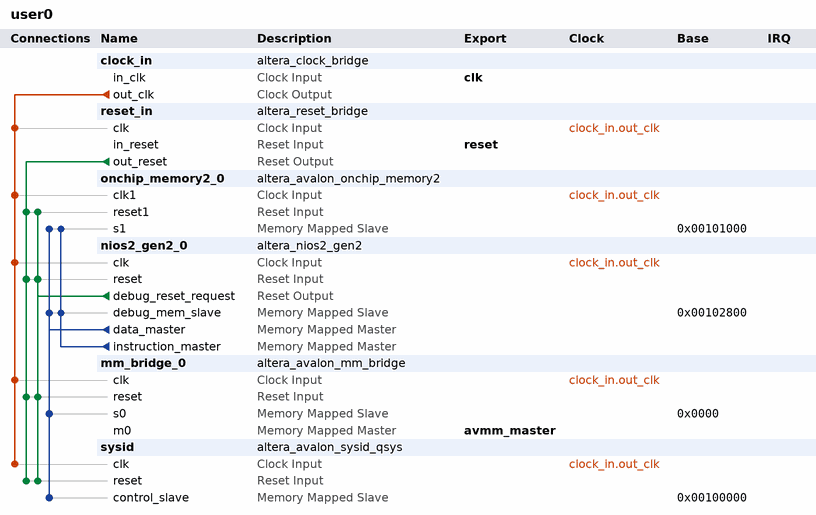
[diagram p0: system contents]
# Platform Designer (Qsys) system user0, Stratix 10 1SG280HU2F50E2VGS1
# Parameters at their usual value, and those the tool derives, are not listed.
package require -exact qsys 1.0
create_system user0
set_project_property DEVICE_FAMILY {Stratix 10}
set_project_property DEVICE 1SG280HU2F50E2VGS1

add_component clock_in ip/user0/user0_clock_in.ip altera_clock_bridge clock_in 18.0
load_component clock_in
set_component_parameter_value DERIVED_CLOCK_RATE 50000000
set_component_parameter_value EXPLICIT_CLOCK_RATE 50000000
save_component

add_component reset_in ip/user0/user0_reset_in.ip altera_reset_bridge reset_in 18.0
load_component reset_in
set_component_parameter_value ACTIVE_LOW_RESET 0
set_component_parameter_value SYNCHRONOUS_EDGES deassert
set_component_parameter_value SYNC_RESET 0
save_component

add_component onchip_memory2_0 ip/user0/user0_onchip_memory2_0.ip altera_avalon_onchip_memory2 onchip_memory2_0 18.0
load_component onchip_memory2_0
set_component_parameter_value dataWidth 32
set_component_parameter_value dualPort false
set_component_parameter_value initMemContent true
set_component_parameter_value initializationFileName onchip_mem.hex
set_component_parameter_value memorySize 4096
save_component

add_component nios2_gen2_0 ip/user0/user0_nios2_gen2_0.ip altera_nios2_gen2 nios2_gen2_0 18.0
load_component nios2_gen2_0
set_component_parameter_value resetSlave onchip_memory2_0.s1
set_component_parameter_value exceptionSlave onchip_memory2_0.s1
set_component_parameter_value impl Tiny
set_component_parameter_value icache_size 2048
set_component_parameter_value dcache_size 2048
save_component

add_component mm_bridge_0 ip/user0/user0_mm_bridge_0.ip altera_avalon_mm_bridge mm_bridge_0 18.0
load_component mm_bridge_0
set_component_parameter_value DATA_WIDTH 32
set_component_parameter_value ADDRESS_WIDTH 20
set_component_parameter_value USE_AUTO_ADDRESS_WIDTH 0
set_component_parameter_value ADDRESS_UNITS SYMBOLS
set_component_parameter_value MAX_PENDING_RESPONSES 4
set_component_parameter_value SYNC_RESET 0
save_component

add_component sysid ip/user0/user0_sysid_qsys_0.ip altera_avalon_sysid_qsys sysid 18.0
load_component sysid
set_component_parameter_value id 0
set_component_parameter_value ID_VALUE 0
set_component_parameter_value TIMESTAMP 0
save_component

# connections
add_connection clock_in.out_clk mm_bridge_0.clk clock
add_connection clock_in.out_clk nios2_gen2_0.clk clock
add_connection clock_in.out_clk onchip_memory2_0.clk1 clock
add_connection clock_in.out_clk reset_in.clk clock
add_connection clock_in.out_clk sysid.clk clock
add_connection nios2_gen2_0.debug_reset_request mm_bridge_0.reset reset
add_connection nios2_gen2_0.debug_reset_request nios2_gen2_0.reset reset
add_connection nios2_gen2_0.debug_reset_request onchip_memory2_0.reset1 reset
add_connection nios2_gen2_0.debug_reset_request sysid.reset reset
add_connection reset_in.out_reset mm_bridge_0.reset reset
add_connection reset_in.out_reset nios2_gen2_0.reset reset
add_connection reset_in.out_reset onchip_memory2_0.reset1 reset
add_connection reset_in.out_reset sysid.reset reset
add_connection nios2_gen2_0.data_master mm_bridge_0.s0 avalon
set_connection_parameter_value nios2_gen2_0.data_master/mm_bridge_0.s0 baseAddress 0x0000
add_connection nios2_gen2_0.data_master nios2_gen2_0.debug_mem_slave avalon
set_connection_parameter_value nios2_gen2_0.data_master/nios2_gen2_0.debug_mem_slave baseAddress 0x00102800
add_connection nios2_gen2_0.data_master onchip_memory2_0.s1 avalon
set_connection_parameter_value nios2_gen2_0.data_master/onchip_memory2_0.s1 baseAddress 0x00101000
add_connection nios2_gen2_0.data_master sysid.control_slave avalon
set_connection_parameter_value nios2_gen2_0.data_master/sysid.control_slave baseAddress 0x00100000
add_connection nios2_gen2_0.instruction_master nios2_gen2_0.debug_mem_slave avalon
set_connection_parameter_value nios2_gen2_0.instruction_master/nios2_gen2_0.debug_mem_slave baseAddress 0x00102800
add_connection nios2_gen2_0.instruction_master onchip_memory2_0.s1 avalon
set_connection_parameter_value nios2_gen2_0.instruction_master/onchip_memory2_0.s1 baseAddress 0x00101000

# exported interfaces
add_interface avmm_master avalon master
set_interface_property avmm_master EXPORT_OF mm_bridge_0.m0
add_interface clk clock sink
set_interface_property clk EXPORT_OF clock_in.in_clk
add_interface reset reset sink
set_interface_property reset EXPORT_OF reset_in.in_reset

set_interconnect_requirement {$system} qsys_mm.clockCrossingAdapter HANDSHAKE
set_interconnect_requirement {$system} qsys_mm.enableEccProtection FALSE
set_interconnect_requirement {$system} qsys_mm.insertDefaultSlave FALSE
set_interconnect_requirement {$system} qsys_mm.maxAdditionalLatency 1

save_system user0.qsys
